# Altium schematic sheet Controller Section.SchDoc
size A; DocumentNumber: 3; SheetNumber: 3; SheetTotal: 30
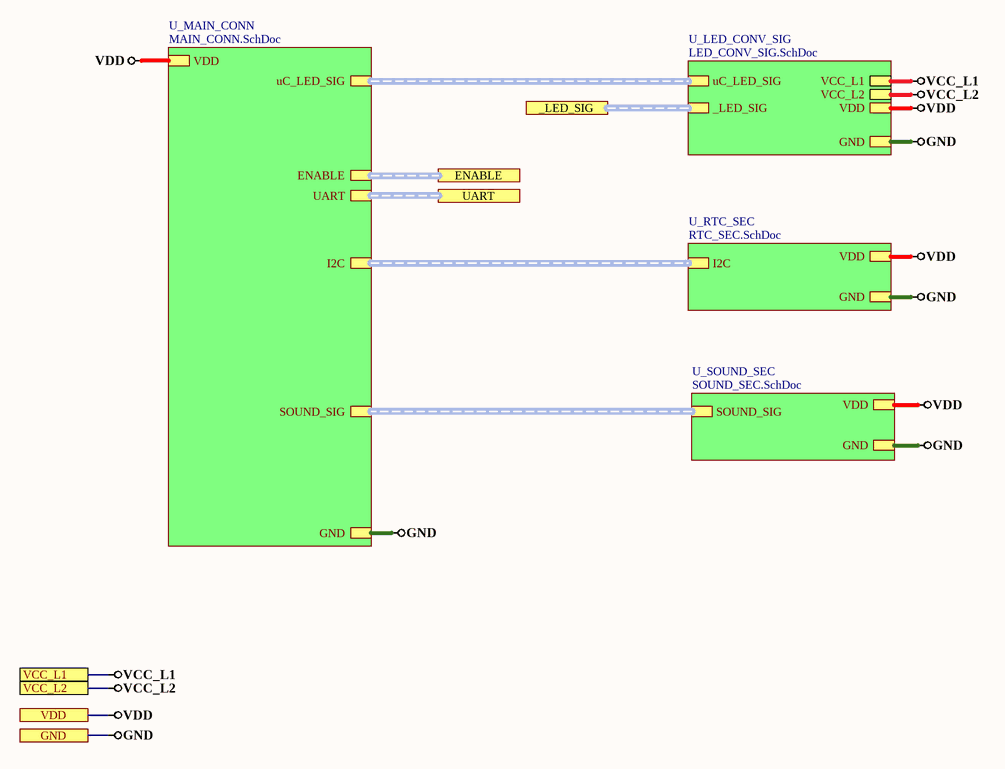
[diagram p0: Controller Section.SchDoc]

## Sub-sheets
U_LED_CONV_SIG = LED_CONV_SIG.SchDoc: GND, VDD, VCC_L1, VCC_L2, uC_LED_SIG (harness Harness_1), _LED_SIG (harness Harness_8)
U_MAIN_CONN = MAIN_CONN.SchDoc: GND, VDD, uC_LED_SIG (harness Harness_1), SOUND_SIG (harness Harness_4), UART (harness Harness), I2C (harness Harness_3), ENABLE (harness Harness_2)
U_RTC_SEC = RTC_SEC.SchDoc: VDD, GND, I2C (harness Harness_3)
U_SOUND_SEC = SOUND_SEC.SchDoc: VDD, GND, SOUND_SIG (harness Harness_4)

## Ports
_LED_SIG (harness Harness_8), ENABLE (harness Harness_2), GND, UART (harness Harness), VCC_L1, VCC_L2, VDD

## Nets
GND: port GND, sheet U_MAIN_CONN/GND, sheet U_SOUND_SEC/GND, sheet U_LED_CONV_SIG/GND, sheet U_RTC_SEC/GND
VCC_L1: port VCC_L1, sheet U_LED_CONV_SIG/VCC_L1
VCC_L2: port VCC_L2, sheet U_LED_CONV_SIG/VCC_L2
VDD: port VDD, sheet U_MAIN_CONN/VDD, sheet U_SOUND_SEC/VDD, sheet U_LED_CONV_SIG/VDD, sheet U_RTC_SEC/VDD

## Buses and harness runs
harness port _LED_SIG = sheet U_LED_CONV_SIG/_LED_SIG
harness port ENABLE = sheet U_MAIN_CONN/ENABLE
harness port UART = sheet U_MAIN_CONN/UART
harness sheet U_LED_CONV_SIG/uC_LED_SIG = sheet U_MAIN_CONN/uC_LED_SIG
harness sheet U_MAIN_CONN/I2C = sheet U_RTC_SEC/I2C
harness sheet U_MAIN_CONN/SOUND_SIG = sheet U_SOUND_SEC/SOUND_SIG